# Altium schematic sheet 01-Power.schdoc
size 307 x 218 mm; Symbol: muban; Device: muban; @Project Name: 12345678; @Create Date: 2025-07-10; @Schematic Name: Mini Oscilloscope; @Page Count: 5; @Update Date: 2025-07-12; @Update Time: 09:15:19; @Page Name: 01-Power; @Page No: 1; @Create Time: 07:20:51; @Board Name: Base Board; Title Block Position: 3; Width: 1170; Height: 825; Region Start: 1; X Region Count: 6; Y Region Count: 4; Blade Width: 10; Description: 模拟题模板
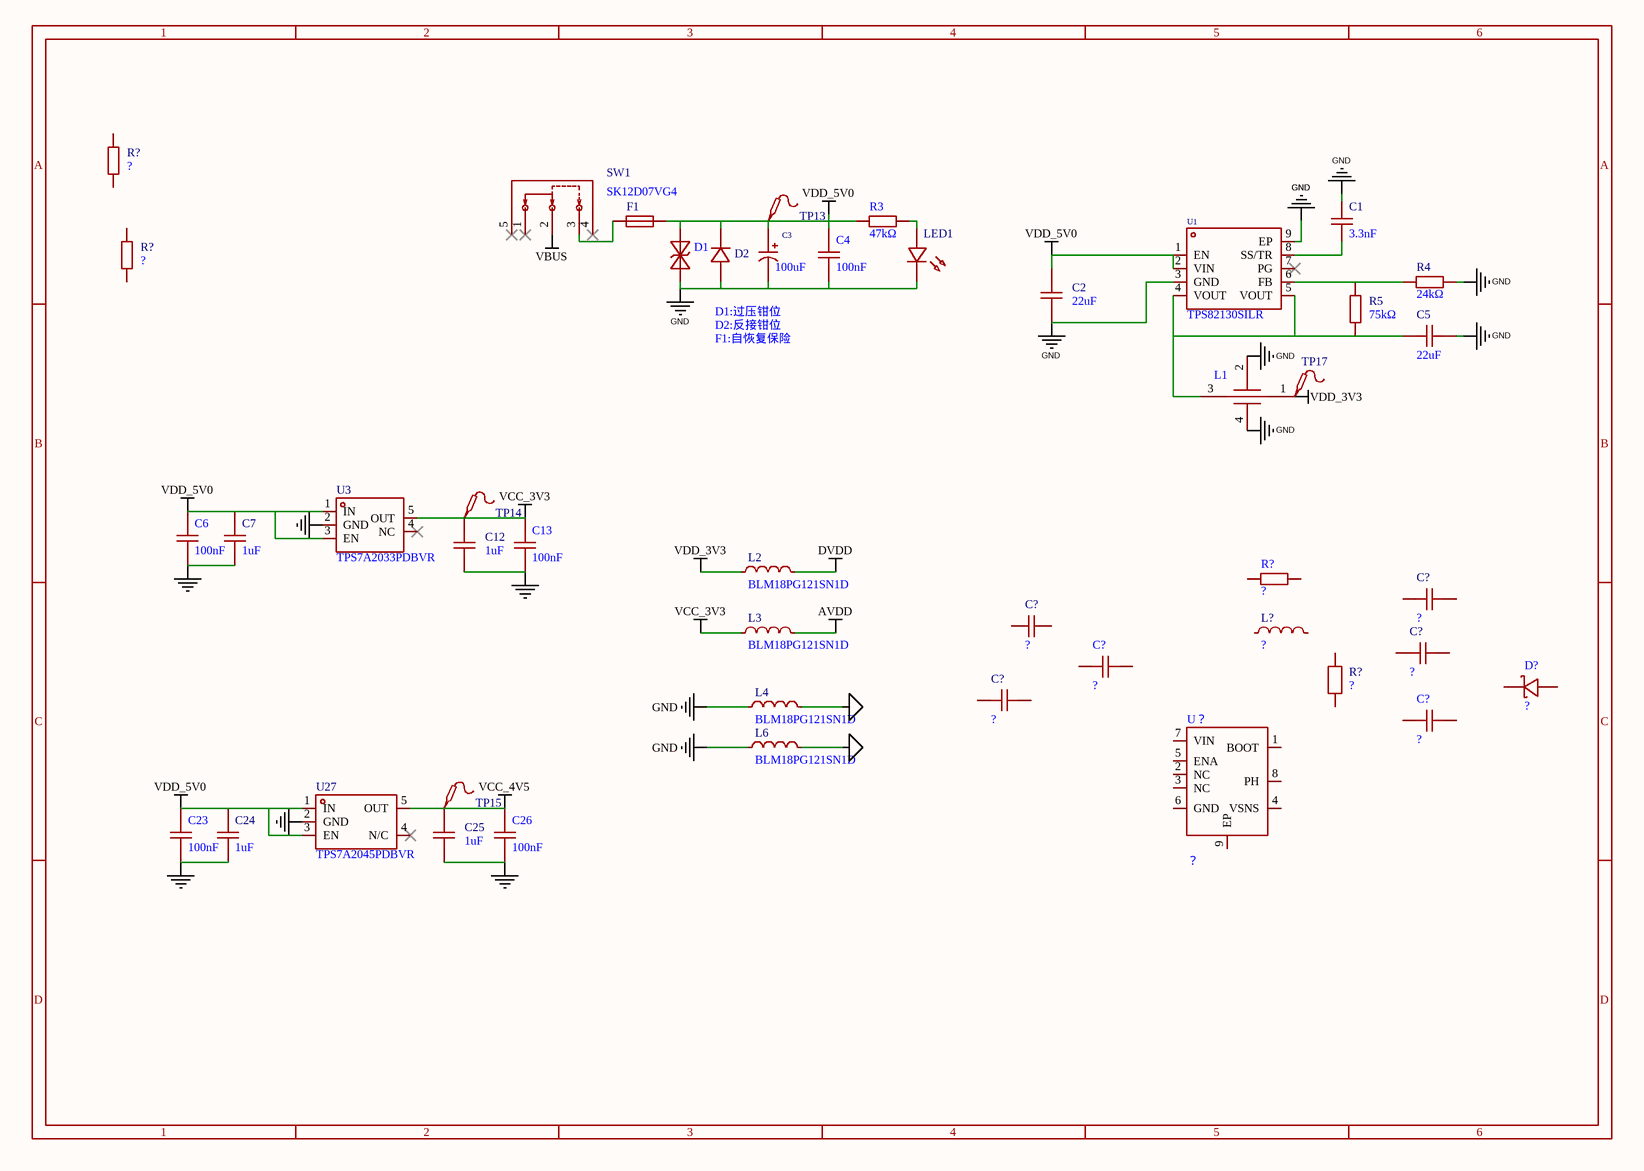
[diagram p0: 01-Power.schdoc]

## Parts
(Parts that share a designator on the sheet are numbered #1, #2 ... from top to bottom, then left to right.)
C1  3.3nF  [C0603]
C2  22uF  [C0805]
C3  100uF  [CAP-SMD_BD6.3-L6.6-W6.6-LS7.4-FD]
C4  100nF  [C0603]
C5  22uF  [C0805]
C6  100nF  [C0603]
C7  1uF  [C0603]
C12  1uF  [C0603]
C13  100nF  [C0603]
C23  100nF  [C0603]
C24  1uF  [C0603]
C25  1uF  [C0603]
C26  100nF  [C0603]
C?#1  ?  [C0805]
C?#2  ?  [C0603]
C?#3  ?  [C0805]
C?#4  ?  [C0603]
C?#5  ?  [C0603]
C?#6  ?  [C0603]
D1  SMBJ14CA  [SMB_L4.5-W3.6-LS5.3-BI]  (value not drawn)
D2  SSL54BF  [SMBF_L4.3-W3.6-LS5.3-RD]  (value not drawn)
D?  ?  [SMA_L4.3-W2.6-LS5.2-RD]
F1  BSMD1812-200-24V  [F1812]  (value not drawn)
L1  NFM21PC104R1E3D  [CAP-SMD_4P-L2.0-W1.25]  (value not drawn)
L2  BLM18PG121SN1D  [L0603]
L3  BLM18PG121SN1D  [L0603]
L4  BLM18PG121SN1D  [L0603]
L6  BLM18PG121SN1D  [L0603]
L?  ?  [IND-SMD_L4.0-W4.0]
LED1  XL-1608UGC-04  [LED0603-RD_GREEN]  (value not drawn)
R3  47kΩ  [R0603]
R4  24kΩ  [R0603]
R5  75kΩ  [R0603]
R?#1  ?  [R0603]
R?#2  ?  [R0603]
R?#3  ?  [R0603]
R?#4  ?  [R0603]
SW1  SK12D07VG4  [SW-TH_SK12D07VG4]
TP13  (no value)  [Test-Point-0.5mm]
TP14  (no value)  [Test-Point-0.5mm]
TP15  (no value)  [Test-Point-0.5mm]
TP17  (no value)  [Test-Point-0.5mm]
U1  TPS82130SILR  [USIP-8_L3.0-W2.8-P0.65-TL-EP]
U3  TPS7A2033PDBVR  [SOT-23-5_L2.9-W1.6-P0.95-LS2.8-BR]
U27  TPS7A2045PDBVR  [SOT-23-5_L2.9-W1.6-P0.95-LS2.8-BR]
U？  ？  [ESOP-8_L4.9-W3.9-P1.27-LS6.0-BL-EP-2]

## Nets
AGND: L4.2 L6.2
AVDD: L3.2
DVDD: L2.2
GND: C1.2 C2.1 C3.2 C4.1 C5.1 C6.1 C7.1 C12.1 C13.1 C23.1 C24.1 C25.1 C26.1 D1.1 D2.2 L1.2(GND) L1.4(GND) L4.1 L6.1 LED1.1(C) R4.2 U1.3(GND) U1.9(EP) U3.2(GND) U27.2(GND)
VBUS: SW1.2
VCC_3V3: C12.2 C13.2 L3.1 TP14.1 U3.5(OUT)
VCC_4V5: C25.2 C26.2 TP15.1 U27.5(OUT)
VDD_3V3: L1.1(IN) L2.1 TP17.1
VDD_5V0: C2.2 C3.1 C4.2 C6.2 C7.2 C23.2 C24.2 D1.2 D2.1 F1.2 R3.1 TP13.1 U1.1(EN) U1.2(VIN) U3.1(IN) U3.3(EN) U27.1(IN) U27.3(EN)
NetC1_1: C1.1 U1.8(SS/TR)
NetC5_2: C5.2 L1.3(OUT) R5.1 U1.4(VOUT) U1.5(VOUT)
NetF1_1: F1.1 SW1.3
NetLED1_2: LED1.2(A) R3.2
NetR4_1: R4.1 R5.2 U1.6(FB)

Not connected (* = marked no-connect by the designer): C?#1 1 2; C?#2 1 2; C?#3 1 2; C?#4 1 2; C?#5 1 2; C?#6 1 2; D? 1(K) 2(A); L? 1 2; R?#1 1 2; R?#2 1 2; R?#3 1 2; R?#4 1 2; SW1 1* 4* 5*; U1 7(PG)*; U3 4(NC)*; U27 4(N/C)*; U？ 1(BOOT) 2(NC) 3(NC) 4(VSNS) 5(ENA) 6(GND) 7(VIN) 8(PH) 9(EP)

## Notes on the sheet
- D1:过压钳位
  D2:反接钳位
  F1:自恢复保险
- 1
- 2
- 3
- 4
- 5
- 6
- A
- B
- C
- D

## Library data of the parts
C1 = CC0603KRX7R9BB332: Manufacturer: YAGEO(国巨); Add into BOM: yes; Tolerance: ±10%; Voltage Rated: 50V; Temperature Coefficient: X7R; Symbol: CC0603KRX7R9BB332; Device: CC0603KRX7R9BB332; LCSC Part Name: 3.3nF ±10% 50V; Supplier Part: C107088; Manufacturer Part: CC0603KRX7R9BB332; Supplier Footprint: 0603; JLCPCB Part Class: 扩展库; Datasheet: https://atta.szlcsc.com/upload/public/pdf/source/20180910/C282072_33301C7F631E79921B82A8DAC6BCC5B3.pdf; Supplier: LCSC; Convert to PCB: yes; Value: 3.3nF
C2 C5 C?#1 C?#3 = CGA0805X5R226M350MT: Manufacturer: HRE(芯声); Add into BOM: yes; Tolerance: ±20%; Voltage Rated: 35V; Temperature Coefficient: X5R; Symbol: CGA0805X5R226M350MT; Device: CGA0805X5R226M350MT; LCSC Part Name: 22uF ±20% 35V; Manufacturer Part: CGA0805X5R226M350MT; Supplier Footprint: 0805; JLCPCB Part Class: 扩展库; Datasheet: https://atta.szlcsc.com/upload/public/pdf/source/20231129/D589D0CC4D260F7AC3A77E53B455CCB3.pdf; Supplier: LCSC; Convert to PCB: yes
  C2 C5: Supplier Part: C6119901; Value: 22uF
  C?#1 C?#3: Value: ?
C3 = RVT100UF35V67RV0034: Manufacturer: KNSCHA(科尼盛); Add into BOM: yes; Rated Voltage: 35V; Lifetime @ Temp: 2000hrs@105℃; Symbol: RVT100UF35V67RV0034; Device: RVT100UF35V67RV0034; Supplier: LCSC; Supplier Part: C2836442; Manufacturer Part: RVT100UF35V67RV0034; Capacitance: 100uF; LCSC Part Name: 100uF 35V; Supplier Footprint: SMD,6.3x7.7mm; Convert to PCB: yes; Value: 100uF; φD: -; L: -; Ripple Current: -; Equivalent Series Resistance(ESR): -
C4 C6 C13 C23 C26 C?#4 C?#6 = CGA0603X7R104K500JT: Manufacturer: HRE(芯声); Symbol: CapAcitance; Add into BOM: yes; Tolerance: ±10%; Voltage Rated: 50V; Temperature Coefficient: X7R; Device: CGA0603X7R104K500JT; LCSC Part Name: 100nF ±10% 50V; Manufacturer Part: CGA0603X7R104K500JT; Supplier Footprint: 0603; JLCPCB Part Class: Extended Part; Datasheet: https://atta.szlcsc.com/upload/public/pdf/source/20250103/C44077DA9E7B3EFAE02F22B6D3D1CBC9.pdf; Supplier: LCSC; Convert to PCB: yes; Voltage Rating: 50V
  C4 C6 C13 C23 C26: Supplier Part: C6119867; Value: 100nF
  C?#4 C?#6: Value: ?
C7 C12 C24 C25 = CGA0603X5R105K500JT: Manufacturer: HRE(芯声); Add into BOM: yes; Tolerance: ±10%; Voltage Rated: 50V; Temperature Coefficient: X5R; Symbol: CGA0603X5R105K500JT; Device: CGA0603X5R105K500JT; LCSC Part Name: 1uF ±10% 50V; Supplier Part: C6119852; Manufacturer Part: CGA0603X5R105K500JT; Supplier Footprint: 0603; JLCPCB Part Class: 扩展库; Supplier: LCSC; Convert to PCB: yes; Value: 1uF
C?#2 = CC0603KRX7R9BB103: Manufacturer: YAGEO(国巨); Add into BOM: yes; Tolerance: ±10%; Voltage Rated: 50V; Temperature Coefficient: X7R; Symbol: CC0603KRX7R9BB103; Device: CC0603KRX7R9BB103; LCSC Part Name: 10nF ±10% 50V; Manufacturer Part: CC0603KRX7R9BB103; Supplier Footprint: 0603; JLCPCB Part Class: Extended Part; Datasheet: https://atta.szlcsc.com/upload/public/pdf/source/20181008/C309510_22F155564471FAF6A489F7D68F34234E.pdf; Supplier: LCSC; Convert to PCB: yes; Value: ?
C?#5 = CGA0603X5R106K100JT: Manufacturer: HRE(芯声); Add into BOM: yes; Tolerance: ±10%; Voltage Rating: 10V; Temperature Coefficient: X5R; Symbol: CGA0603X5R106K100JT; Device: CGA0603X5R106K100JT; LCSC Part Name: 10uF ±10% 10V; Manufacturer Part: CGA0603X5R106K100JT; Supplier Footprint: 0603; JLCPCB Part Class: 扩展库; Supplier: LCSC; Convert to PCB: yes; Value: ?
D1 = SMBJ14CA_C908847: Manufacturer: GOODWORK(固得沃克); Add into BOM: yes; Polarity: 双向; Reverse Stand-Off Voltage (Vrwm): 14V; Breakdown Voltage (Min): 15.6V; Breakdown Voltage (Max): 17.9V; Reverse Leakage Current (Ir): 5μA; Peak Pulse Current (Ipp)@10/1000μs: 25.8A; Maximum Clamping Voltage: 23.2V; Symbol: SMBJ14CA_C908847; Device: SMBJ14CA_C908847; LCSC Part Name: 双向 Vrwm:14V; Supplier Part: C908847; Manufacturer Part: SMBJ14CA; Supplier Footprint: SMB; JLCPCB Part Class: 扩展库; Datasheet: https://atta.szlcsc.com/upload/public/pdf/source/20201231/C908783_5F0AE07776753216FC0A4122EEBBB8E2.pdf; Supplier: LCSC; Convert to PCB: yes
D2 = SSL54BF: Manufacturer: 晶导微电子; Add into BOM: yes; Reverse Voltage (Vr): 40V; Average Rectified Current (Io): 5A; Forward Voltage (Vf@If): 450mV@5A; Reverse Leakage Current (Ir): 1mA@40V; Peak forward surge current: 150A; Symbol: SSL54BF; Device: SSL54BF; Supplier: LCSC; Supplier Part: C116130; Manufacturer Part: SSL54BF; JLCPCB Part Class: 扩展库; LCSC Part Name: 电压:40V 电流:5A; Supplier Footprint: SMBF; Datasheet: https://atta.szlcsc.com/upload/public/pdf/source/20180620/C116130_E569A904505A924250F94391221EA411.pdf; Convert to PCB: yes
D? = SS34_C8678: Manufacturer: MDD; Add into BOM: yes; Diode Configuration: 独立式; Reverse Voltage (Vr): 40V; Average Rectified Current (Io): 3A; Forward Voltage (Vf@If): 550mV@3A; Reverse Leakage Current (Ir): 500uA@40V; Symbol: SS34_C8678; Device: SS34_C8678; LCSC Part Name: 40V 3A 550mV@3A; Supplier Part: C8678; Manufacturer Part: ?; Supplier Footprint: SMA(DO-214AC); JLCPCB Part Class: Basic Part; Datasheet: https://atta.szlcsc.com/upload/public/pdf/source/20230314/A80AE34493C69B89E2F4B1712F433538.pdf; Supplier: LCSC; Convert to PCB: yes
F1 = BSMD1812-200-24V: Manufacturer: BHFUSE(佰宏); Add into BOM: yes; Operating Voltage (Max): 24V; Current Rating (Max): 40A; Hold Current: 2A; Trip Current: 4A; Power Dissipation: 1W; Resistance - Initial (Ri) (Min): 20mΩ; Resistance - Post Trip (R1) (Max): 100mΩ; Maximum Time to Trip: 2s; Symbol: BSMD1812-200-24V; Device: BSMD1812-200-24V; Supplier: LCSC; Supplier Part: C883157; Manufacturer Part: BSMD1812-200-24V; JLCPCB Part Class: 扩展库; LCSC Part Name: 24V 2A 1812自恢复; Supplier Footprint: 1812; Datasheet: https://atta.szlcsc.com/upload/public/pdf/source/20230512/6ED7FF50F668B3AF958C55F12246A840.pdf; Convert to PCB: yes; Operating Temperature: -40℃~+85℃
L1 = NFM21PC104R1E3D: Manufacturer: muRata(村田); Add into BOM: yes; Nominal Capacitance: 100nF; CapacitanceTolerance: ±20%; DC Rated Voltage: 25V; Rated Current: 2A; DC Resistance: 30mΩ; Symbol: NFM21PC104R1E3D; Device: NFM21PC104R1E3D; LCSC Part Name: 100nF(104) ±20% 25V; Supplier Part: C86150; Manufacturer Part: NFM21PC104R1E3D; Supplier Footprint: 0805; JLCPCB Part Class: 扩展库; Datasheet: https://atta.szlcsc.com/upload/public/pdf/source/20180326/C86150_E4B7366323682FA84DED9003C68CA797.pdf; Supplier: LCSC; Convert to PCB: yes; Operating Temperature: -55℃~+125℃
L2-L4 L6 = BLM18PG121SN1D: Manufacturer: muRata(村田); Symbol: BLM18PG121SN1D_C14709; Add into BOM: yes; Impedance @ Frequency: 120Ω@100MHz; Tolerance: ±25%; DC Resistance: 50mΩ; Current Rating: 2A; Circuits: 1; Device: BLM18PG121SN1D; LCSC Part Name: 单路 0603磁珠 阻抗120Ω@100MHz; Supplier Part: C14709; Manufacturer Part: BLM18PG121SN1D; Supplier Footprint: 0603; JLCPCB Part Class: 扩展库; Datasheet: https://atta.szlcsc.com/upload/public/pdf/source/20130704/1457706621422.pdf; Supplier: LCSC; Convert to PCB: yes
L? = FHD4020S-150MT: Manufacturer: cjiang(长江微电); Add into BOM: yes; Tolerance: ±20%; Current Rating: 1.2A; Current - Saturation(Isat): 2.8A; DC Resistance(DCR): 305mΩ; Type: 绕线电感; Symbol: FHD4020S-150MT; Device: FHD4020S-150MT; LCSC Part Name: 15uH ±20% 2.8A; Manufacturer Part: FHD4020S-150MT; Supplier Footprint: SMD,4x4mm; JLCPCB Part Class: 扩展库; Datasheet: https://atta.szlcsc.com/upload/public/pdf/source/20200609/C601990_BCEA243EC4DA0A9A288AA78A6DFB48A5.pdf; Supplier: LCSC; Convert to PCB: yes; Value: ?
LED1 = XL-1608UGC-04: Manufacturer: XINGLIGHT(成兴光); Symbol: LED_G; Convert to PCB: yes; Emitted Color: 翠绿色; Forward Voltage (VF): 3.3V; Power Dissipation: 80mW; Forward Current: 25mA; Dominant Wavelength: 516nm~525nm; Peak Wavelength: 534nm; Lens Color: 无色透明透镜; Luminous Intensity: 199mcd; Viewing Angle: 120°; Mounting Sytle: 正贴; Device: XL-1608UGC-04; Add into BOM: yes; Supplier Footprint: 0603; LCSC Part Name: XL-1608UGC-04; Supplier Part: C965804; Manufacturer Part: XL-1608UGC-04; JLCPCB Part Class: Extended Part; Datasheet: https://atta.szlcsc.com/upload/public/pdf/source/20221102/520D6E465E5CFD1609C8A4DBC80D4018.pdf; Supplier: LCSC; Lamp Holder Type: -; Diode Configuration: -; Color Temperature: -; Operating Temperature: -30℃~+85℃
R3 = 0603WAF4702T5E: Manufacturer: UNI-ROYAL(厚声); Symbol: 电阻; Add into BOM: yes; Tolerance: ±1%; Power(Watts): 100mW; Overload Voltage (Max): 75V; Temperature Coefficient: ±100ppm/℃; Device: 0603WAF4702T5E; LCSC Part Name: 47kΩ ±1% 100mW 厚膜电阻; Supplier Part: C25819; Manufacturer Part: 0603WAF4702T5E; Supplier Footprint: 0603; JLCPCB Part Class: Basic Part; Datasheet: https://atta.szlcsc.com/upload/public/pdf/source/20200306/C422600_1E6D84923E4A46A82E41ADD87F860B5C.pdf; Supplier: LCSC; Convert to PCB: yes; Type: 厚膜电阻; Value: 47kΩ; Operating Temperature Range: -55℃~+155℃
R4 = 0603WAF2402T5E: Manufacturer: UNI-ROYAL(厚声); Add into BOM: yes; Tolerance: ±1%; Power(Watts): 100mW; Overload Voltage (Max): 75V; Temperature Coefficient: ±100ppm/℃; Symbol: 0603WAF2402T5E; Device: 0603WAF2402T5E; Supplier: LCSC; Manufacturer Part: 0603WAF2402T5E; Supplier Part: C23352; Value: 24kΩ; JLCPCB Part Class: 基础库; LCSC Part Name: 24kΩ ±1% 100mW 厚膜电阻; Supplier Footprint: 0603; Datasheet: https://atta.szlcsc.com/upload/public/pdf/source/20200306/C422600_1E6D84923E4A46A82E41ADD87F860B5C.pdf; Convert to PCB: yes; Type: 厚膜电阻; Operating Temperature Range: -55℃~+155℃
R5 = 0603WAF7502T5E: Manufacturer: UNI-ROYAL(厚声); Add into BOM: yes; Tolerance: ±1%; Power(Watts): 100mW; Overload Voltage (Max): 75V; Temperature Coefficient: ±100ppm/℃; Symbol: 0603WAF7502T5E; Device: 0603WAF7502T5E; LCSC Part Name: 75kΩ ±1% 100mW 厚膜电阻; Supplier Part: C23242; Manufacturer Part: 0603WAF7502T5E; Supplier Footprint: 0603; JLCPCB Part Class: 基础库; Datasheet: https://atta.szlcsc.com/upload/public/pdf/source/20200306/C422600_1E6D84923E4A46A82E41ADD87F860B5C.pdf; Supplier: LCSC; Convert to PCB: yes; Type: 厚膜电阻; Value: 75kΩ; Operating Temperature Range: -55℃~+155℃
R?#1 R?#2 = 0603WAF5101T5E: Manufacturer: UNI-ROYAL(厚声); Add into BOM: yes; Tolerance: ±1%; Power(Watts): 100mW; Overload Voltage (Max): 75V; Temperature Coefficient: ±100ppm/℃; Symbol: 0603WAF5101T5E; Device: 0603WAF5101T5E; LCSC Part Name: 5.1kΩ ±1% 100mW 厚膜电阻; Manufacturer Part: 0603WAF5101T5E; Supplier Footprint: 0603; JLCPCB Part Class: 基础库; Datasheet: https://atta.szlcsc.com/upload/public/pdf/source/20200306/C422600_1E6D84923E4A46A82E41ADD87F860B5C.pdf; Supplier: LCSC; Convert to PCB: yes; Type: 厚膜电阻; Value: ?; Operating Temperature Range: -55℃~+155℃
R?#3 = 0603WAF1002T5E: Manufacturer: UNI-ROYAL(厚声); Symbol: 电阻; Add into BOM: yes; Tolerance: ±1%; Power(Watts): 100mW; Temperature Coefficient: ±100ppm/℃; Overload Voltage (Max): 75V; Device: 0603WAF1002T5E; LCSC Part Name: 厚膜电阻 10kΩ ±1% 100mW; Manufacturer Part: 0603WAF1002T5E; Supplier Footprint: 0603; JLCPCB Part Class: Basic Part; Datasheet: https://atta.szlcsc.com/upload/public/pdf/source/20200306/C422600_1E6D84923E4A46A82E41ADD87F860B5C.pdf; Supplier: LCSC; Convert to PCB: yes; Type: 厚膜电阻; Value: ?; Operating Temperature Range: -55℃~+155℃
R?#4 = FRC0603F3741TS: Manufacturer: FOJAN(富捷); Add into BOM: yes; Tolerance: ±1%; Power(Watts): 100mW; Overload Voltage (Max): 75V; Temperature Coefficient: ±100ppm/℃; Symbol: FRC0603F3741TS; Device: FRC0603F3741TS; LCSC Part Name: 3.74kΩ ±1% 100mW 厚膜电阻; Manufacturer Part: FRC0603F3741TS; Supplier Footprint: 0603; JLCPCB Part Class: 扩展库; Datasheet: https://atta.szlcsc.com/upload/public/pdf/source/20211221/925EC7D7225764EE0046F22065062C87.pdf; Supplier: LCSC; Convert to PCB: yes; Type: 厚膜电阻; Value: ?; Operating Temperature Range: -55℃~+155℃
SW1 = SK12D07VG4: Manufacturer: SHOU HAN(首韩); Add into BOM: yes; Circuit: 单刀双掷; Actuator Style: 矩形柱状; Pin Style: PC引脚; Switch Height: 8.8mm; Current Rating (DC): 500mA; Voltage Rating (DC): 50V; Mechanical Life: 5千次; Symbol: SK12D07VG4; Device: SK12D07VG4; LCSC Part Name: 3脚2档位 卧插 滑动开关; Supplier Part: C393937; Manufacturer Part: SK12D07VG4; Supplier Footprint: 插件; JLCPCB Part Class: 扩展库; Datasheet: https://atta.szlcsc.com/upload/public/pdf/source/20190521/C393937_939FE26E571CC67D2D532E953108A1B0.pdf; Supplier: LCSC; Convert to PCB: yes; Mounting Style: -; Current Rating (AC): -; Voltage Rating (AC): -; Operating Temperature: -
TP13-TP15 TP17 = Test-Point: Add into BOM: yes; Symbol: Test-Point; Device: Test-Point; Convert to PCB: yes
U1 = TPS82130SILR: Manufacturer: TI(德州仪器); Add into BOM: yes; Output Channel: 1; Input Voltage(DC): 3V~17V; Output Voltage: 900mV~6V; Output Current (Max): 3A; Symbol: TPS82130SILR; Device: TPS82130SILR; Supplier: LCSC; Supplier Part: C473914; Manufacturer Part: TPS82130SILR; JLCPCB Part Class: 扩展库; LCSC Part Name: TPS82130SILR; Supplier Footprint: USIP-8; Datasheet: https://www.ti.com/cn/lit/gpn/tps82130; Convert to PCB: yes; Function: -
U3 = TPS7A2033PDBVR: Manufacturer: TI(德州仪器); Add into BOM: yes; Output Type: 固定; Maximum Input Voltage: 6V; Output Voltage: 3.3V; MAX Output Current: 300mA; Dropout Voltage: 140mV@(300mA); standby current: 15uA; Output Polarity: 正极; Number of Outputs: 1; Symbol: TPS7A2033PDBVR; Device: TPS7A2033PDBVR; LCSC Part Name: 具有高 PSRR 的 300mA、超低噪声、低 IQ、低压降 (LDO) 线性稳压器; Supplier Part: C2862740; Manufacturer Part: TPS7A2033PDBVR; Supplier Footprint: SOT-23-5; JLCPCB Part Class: Extended Part; Datasheet: https://www.ti.com/cn/lit/gpn/tps7a20; Supplier: LCSC; Convert to PCB: yes; Operating Temperature: -40℃~+125℃@(Tj); Output Current: 300mA; Feature: 防静电保护；软启动；浪涌保护；低ESR；热保护(TSD)；欠压闭锁；过流保护(OCP)；带使能；防倒灌
U27 = TPS7A2045PDBVR: Manufacturer: TI(德州仪器); Add into BOM: yes; Output Type: 固定; Maximum Input Voltage: 6V; Output Voltage: 4.5V; Output Current: 300mA; Dropout Voltage: 145mV@(300mA); standby current: 15uA; Output Polarity: 正极; Number of Outputs: 1; Symbol: TPS7A2045PDBVR; Device: TPS7A2045PDBVR; LCSC Part Name: 具有高 PSRR 的 300mA、超低噪声、低 IQ、低压降 (LDO) 线性稳压器; Supplier Part: C2873627; Manufacturer Part: TPS7A2045PDBVR; Supplier Footprint: SOT-23-5; JLCPCB Part Class: 扩展库; Datasheet: https://www.ti.com/cn/lit/gpn/tps7a20; Supplier: LCSC; Convert to PCB: yes; Feature: 防静电保护；软启动；浪涌保护；低ESR；热保护(TSD)；欠压闭锁；过流保护(OCP)；带使能；防倒灌; Operating Temperature: -40℃~+125℃@(Tj)
U？ = TPS5430DDA: Manufacturer: TI(德州仪器); Add into BOM: yes; Function: 降压型; Synchronous Rectification: 否; Output Type: 可调; Number of Outputs: 1; Topology: 降压式; Input Voltage: 5.5V~36V; Output Voltage: 1.221V~32.04V; Output Current (Max): 3A; Switching Frequency: 500kHz; Symbol: TPS5430DDA; Device: TPS5430DDA; LCSC Part Name: 降压型 Vin=5.5V~36V Vout=1.221V~32.04V 3A; Supplier Part: C502477; Manufacturer Part: ？; Supplier Footprint: ESOP-8; JLCPCB Part Class: Extended Part; Datasheet: https://atta.szlcsc.com/upload/public/pdf/source/20200402/C502477_C195E9F29489A337252CB245AFB38C93.pdf; Supplier: LCSC; Convert to PCB: yes; Operating Temperature: -40℃~+125℃@(TJ)